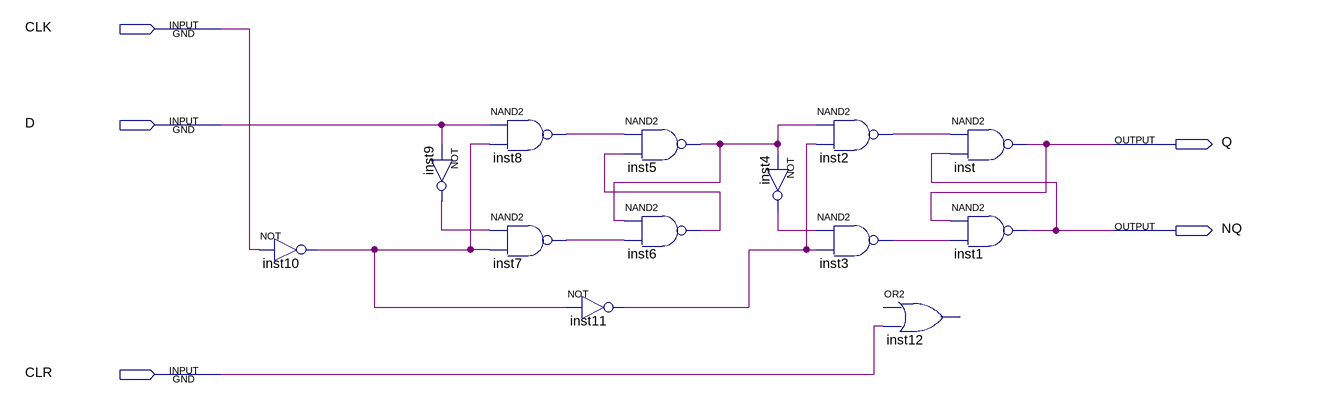
[diagram p0: schematic sheet]
// Quartus schematic DFF_Master_Slave.bdf as structural Verilog: 13 symbols, 5 pins
module DFF_Master_Slave (
  input  CLK,
  input  D,
  input  CLR,
  output Q,
  output NQ
);

  wire inst2_out, inst3_out, inst4_out, inst5_out, inst6_out, inst7_out, inst8_out, inst9_out, inst10_out,
       inst11_out;

  not inst10 (inst10_out, CLK);
  not inst9 (inst9_out, D);
  nand inst8 (inst8_out, D, inst10_out);
  nand inst7 (inst7_out, inst9_out, inst10_out);
  not inst11 (inst11_out, inst10_out);
  nand inst5 (inst5_out, inst8_out, inst6_out);
  nand inst6 (inst6_out, inst5_out, inst7_out);
  not inst4 (inst4_out, inst5_out);
  nand inst2 (inst2_out, inst5_out, inst11_out);
  nand inst3 (inst3_out, inst4_out, inst11_out);
  // OR2 inst12 has open pins: IN1=open, IN2=CLR, OUT=open
  nand inst (Q, inst2_out, NQ);
  nand inst1 (NQ, Q, inst3_out);
endmodule
